# Altium schematic sheet Licznik_mili_sekund.SchDoc
size A4; SheetNumber: 7; SheetTotal: 8
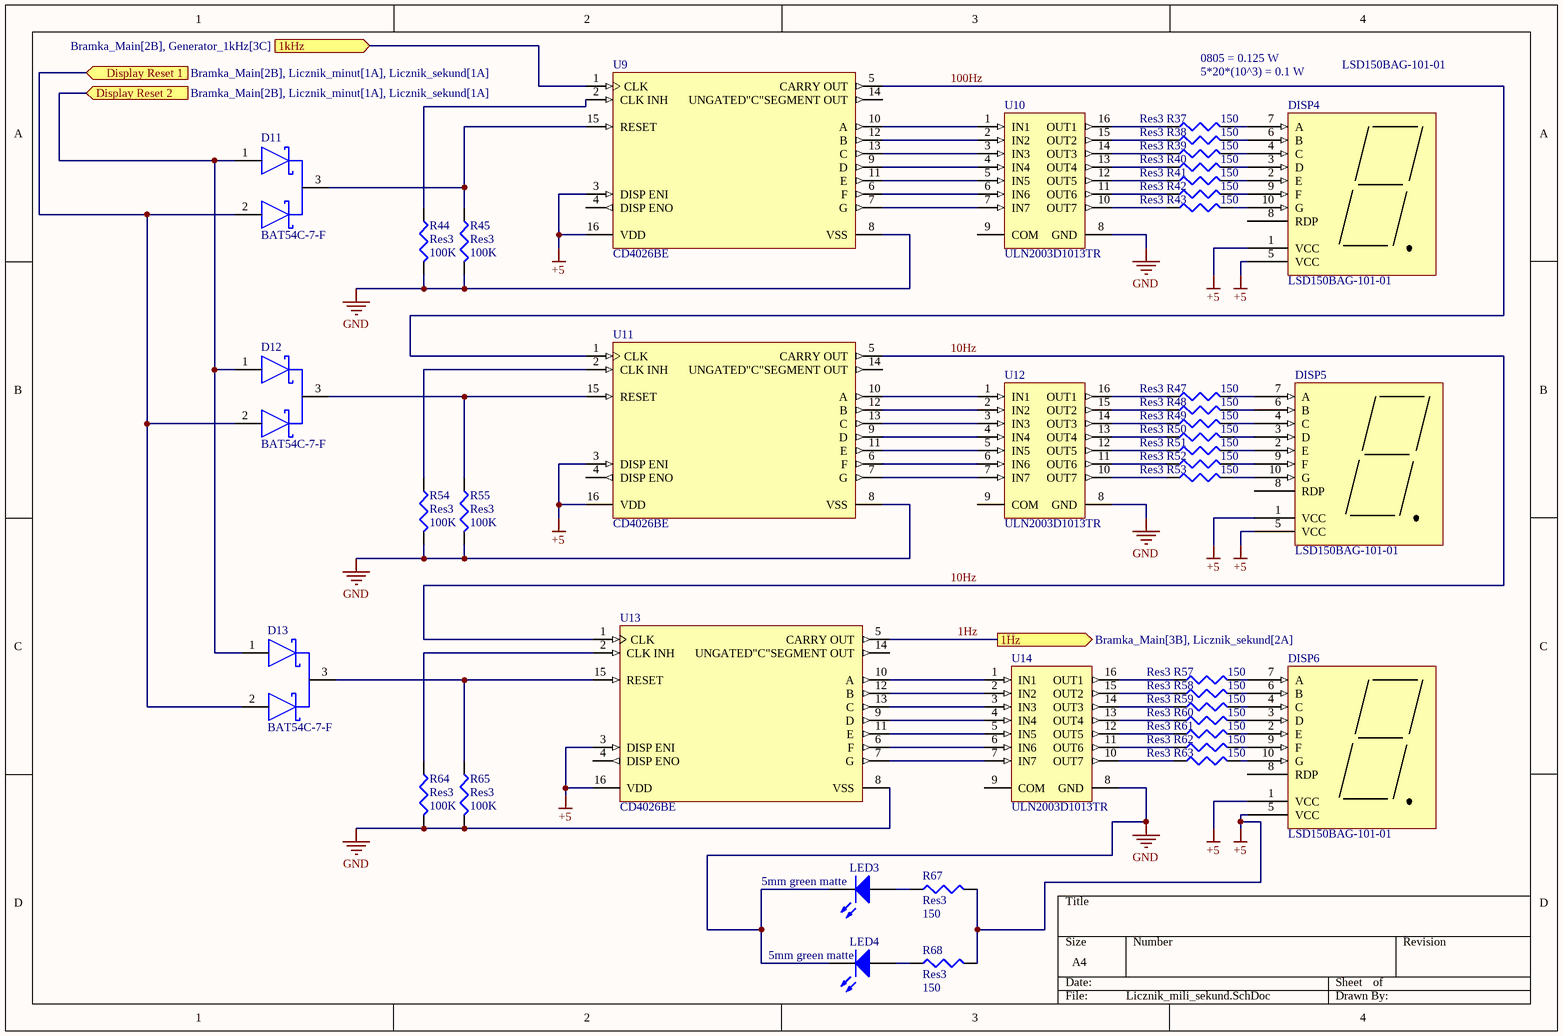
[diagram p0: Licznik_mili_sekund.SchDoc]

## Parts
D11  BAT54C-7-F  [FP-SOT23-IPC_B]
D12  BAT54C-7-F  [FP-SOT23-IPC_B]
D13  BAT54C-7-F  [FP-SOT23-IPC_B]
DISP4  LSD150BAG-101-01  [7 segment display]
DISP5  LSD150BAG-101-01  [7 segment display]
DISP6  LSD150BAG-101-01  [7 segment display]
LED3  5mm green matte  [Type 5mm]
LED4  5mm green matte  [Type 5mm]
R37  Res3  value 150  [6-0805_M]
R38  Res3  value 150  [6-0805_M]
R39  Res3  value 150  [6-0805_M]
R40  Res3  value 150  [6-0805_M]
R41  Res3  value 150  [6-0805_M]
R42  Res3  value 150  [6-0805_M]
R43  Res3  value 150  [6-0805_M]
R44  Res3  value 100K  [J1-0603]
R45  Res3  value 100K  [J1-0603]
R47  Res3  value 150  [6-0805_M]
R48  Res3  value 150  [6-0805_M]
R49  Res3  value 150  [6-0805_M]
R50  Res3  value 150  [6-0805_M]
R51  Res3  value 150  [6-0805_M]
R52  Res3  value 150  [6-0805_M]
R53  Res3  value 150  [6-0805_M]
R54  Res3  value 100K  [J1-0603]
R55  Res3  value 100K  [J1-0603]
R57  Res3  value 150  [6-0805_M]
R58  Res3  value 150  [6-0805_M]
R59  Res3  value 150  [6-0805_M]
R60  Res3  value 150  [6-0805_M]
R61  Res3  value 150  [6-0805_M]
R62  Res3  value 150  [6-0805_M]
R63  Res3  value 150  [6-0805_M]
R64  Res3  value 100K  [J1-0603]
R65  Res3  value 100K  [J1-0603]
R67  Res3  value 150  [6-0805_M]
R68  Res3  value 150  [6-0805_M]
U9  CD4026BE  [N0016A]
U10  ULN2003D1013TR  [STM-SO-16_M]
U11  CD4026BE  [N0016A]
U12  ULN2003D1013TR  [STM-SO-16_M]
U13  CD4026BE  [N0016A]
U14  ULN2003D1013TR  [STM-SO-16_M]

## Ports
1Hz (out, see Bramka_Main[3B], Licznik_sekund[2A]), 1kHz (in, see Bramka_Main[2B], Generator_1kHz[3C]), Display Reset 1 (in, see Bramka_Main[2B], Licznik_minut[1A], Licznik_sekund[1A]), Display Reset 2 (in, see Bramka_Main[2B], Licznik_minut[1A], Licznik_sekund[1A])

## Nets
+5: DISP4.1(VCC) DISP4.5(VCC) DISP5.1(VCC) DISP5.5(VCC) DISP6.1(VCC) DISP6.5(VCC) R67.2 R68.2 U9.3(DISP_ENI) U9.16(VDD) U11.3(DISP_ENI) U11.16(VDD) U13.3(DISP_ENI) U13.16(VDD)
GND: LED3.1(K) LED4.1(K) R44.2 R45.2 R54.2 R55.2 R64.2 R65.2 U9.8(VSS) U10.8(GND) U11.8(VSS) U12.8(GND) U13.8(VSS) U14.8(GND)
1Hz: U13.5(CARRY_OUT) ; port 1Hz
1kHz: U9.1(CLK) ; port 1kHz
10Hz: U11.5(CARRY_OUT) U13.1(CLK)
100Hz: U9.5(CARRY_OUT) U11.1(CLK)
Display Reset 1: D11.2(2_ANODE) D12.2(2_ANODE) D13.2(2_ANODE) ; port Display Reset 1
Display Reset 2: D11.1(1_ANODE) D12.1(1_ANODE) D13.1(1_ANODE) ; port Display Reset 2
NetD11_3: D11.3(COMMON_CATHODE) R45.1 U9.15(RESET)
NetD12_3: D12.3(COMMON_CATHODE) R55.1 U11.15(RESET)
NetD13_3: D13.3(COMMON_CATHODE) R65.1 U13.15(RESET)
NetDISP4_2: DISP4.2(E) R41.2
NetDISP4_3: DISP4.3(D) R40.2
NetDISP4_4: DISP4.4(C) R39.2
NetDISP4_6: DISP4.6(B) R38.2
NetDISP4_7: DISP4.7(A) R37.2
NetDISP4_9: DISP4.9(F) R42.2
NetDISP4_10: DISP4.10(G) R43.2
NetDISP5_2: DISP5.2(E) R51.2
NetDISP5_3: DISP5.3(D) R50.2
NetDISP5_4: DISP5.4(C) R49.2
NetDISP5_6: DISP5.6(B) R48.2
NetDISP5_7: DISP5.7(A) R47.2
NetDISP5_9: DISP5.9(F) R52.2
NetDISP5_10: DISP5.10(G) R53.2
NetDISP6_2: DISP6.2(E) R61.2
NetDISP6_3: DISP6.3(D) R60.2
NetDISP6_4: DISP6.4(C) R59.2
NetDISP6_6: DISP6.6(B) R58.2
NetDISP6_7: DISP6.7(A) R57.2
NetDISP6_9: DISP6.9(F) R62.2
NetDISP6_10: DISP6.10(G) R63.2
NetLED3_2: LED3.2(A) R67.1
NetLED4_2: LED4.2(A) R68.1
NetR37_1: R37.1 U10.16(OUT1)
NetR38_1: R38.1 U10.15(OUT2)
NetR39_1: R39.1 U10.14(OUT3)
NetR40_1: R40.1 U10.13(OUT4)
NetR41_1: R41.1 U10.12(OUT5)
NetR42_1: R42.1 U10.11(OUT6)
NetR43_1: R43.1 U10.10(OUT7)
NetR44_1: R44.1 U9.2(CLK_INH)
NetR47_1: R47.1 U12.16(OUT1)
NetR48_1: R48.1 U12.15(OUT2)
NetR49_1: R49.1 U12.14(OUT3)
NetR50_1: R50.1 U12.13(OUT4)
NetR51_1: R51.1 U12.12(OUT5)
NetR52_1: R52.1 U12.11(OUT6)
NetR53_1: R53.1 U12.10(OUT7)
NetR54_1: R54.1 U11.2(CLK_INH)
NetR57_1: R57.1 U14.16(OUT1)
NetR58_1: R58.1 U14.15(OUT2)
NetR59_1: R59.1 U14.14(OUT3)
NetR60_1: R60.1 U14.13(OUT4)
NetR61_1: R61.1 U14.12(OUT5)
NetR62_1: R62.1 U14.11(OUT6)
NetR63_1: R63.1 U14.10(OUT7)
NetR64_1: R64.1 U13.2(CLK_INH)
NetU9_6: U9.6(F) U10.6(IN6)
NetU9_7: U9.7(G) U10.7(IN7)
NetU9_9: U9.9(D) U10.4(IN4)
NetU9_10: U9.10(A) U10.1(IN1)
NetU9_11: U9.11(E) U10.5(IN5)
NetU9_12: U9.12(B) U10.2(IN2)
NetU9_13: U9.13(C) U10.3(IN3)
NetU11_6: U11.6(F) U12.6(IN6)
NetU11_7: U11.7(G) U12.7(IN7)
NetU11_9: U11.9(D) U12.4(IN4)
NetU11_10: U11.10(A) U12.1(IN1)
NetU11_11: U11.11(E) U12.5(IN5)
NetU11_12: U11.12(B) U12.2(IN2)
NetU11_13: U11.13(C) U12.3(IN3)
NetU13_6: U13.6(F) U14.6(IN6)
NetU13_7: U13.7(G) U14.7(IN7)
NetU13_9: U13.9(D) U14.4(IN4)
NetU13_10: U13.10(A) U14.1(IN1)
NetU13_11: U13.11(E) U14.5(IN5)
NetU13_12: U13.12(B) U14.2(IN2)
NetU13_13: U13.13(C) U14.3(IN3)

Not connected (* = marked no-connect by the designer): DISP4 8(RDP); DISP5 8(RDP); DISP6 8(RDP); U9 4(DISP_ENO) 14(UNGATED"C"SEGMENT_OUT); U10 9(COM); U11 4(DISP_ENO) 14(UNGATED"C"SEGMENT_OUT); U12 9(COM); U13 4(DISP_ENO) 14(UNGATED"C"SEGMENT_OUT); U14 9(COM)

## Notes on the sheet
- 5*20*(10^3) = 0.1 W
- 0805 = 0.125 W
- LSD150BAG-101-01

## Library data of the parts
D11-D13 = CMP-12790-000084-1: DIODE ARRAY SCHOTTKY 30V SOT23-3; Max Reverse Current: 2uA; Power Dissipation: 200mW; Average Rectified Current: 200mA; Capacitance: 10pF; Peak Non-Repetitive Surge Current: 600mA; Forward Voltage: 800mV; Reverse Recovery Time: 5ns; Element Configuration: Common Cathode; Max Operating Temperature: 150°C; Max Reverse Voltage (DC): 30V; Power Rating: 200mW; Termination: SMD/SMT; REACH SVHC: No SVHC; Voltage Rating (DC): 30V; Series: -; Current Rating: 200mA; RoHS Compliant: Yes; Max Power Dissipation: 200mW; Case/Package: SOT-23; Max Repetitive Reverse Voltage (Vrrm): 30V; Width: 1.3mm; Min Operating Temperature: -65°C; Lead Free: Lead Free; Forward Current: 200mA; Number of Pins: 3; Contact Plating: Tin; Package Quantity: 3000; Length: 2.9mm; Radiation Hardening: No; Max Forward Surge Current (Ifsm): 600mA; Height: 1mm; Packaging: Tape and Reel; Mount: Surface Mount; Weight: 0.000282oz
DISP4-DISP6 = CMP-007-00036-2: 7 segment display 1.5 inch
LED3 LED4 = CMP-1488-00007-1: THT LED round mono-color color lens, WL-TMRW, Bright Green; PartNumber: 151051VS04000; Manufacturer: Wuerth Elektronik; Emitting color: Bright Green; ComponentLink1Description: Manufacturer URL; PackageReference: Type 5mm; ComponentLink2URL: http://katalog.we-online.de/pbs/datasheet/7448042001.pdfhttp://katalog.we-online.de/pbs/datasheet/7448042001.pdfhttp://katalog.we-online.de/pbs/datasheet/7448042001.pdfhttp://katalog.we-online.de/pbs/datasheet/151051VS04000.pdf; ComponentLink1URL: http://www.we-online.com; ComponentLink2Description: Datasheet
R37-R45 R47-R55 R57-R65 R67 R68 = Res3: Resistor; Published: 8-Jun-2000; LatestRevisionDate: 29-May-2009; LatestRevisionNote: IPC-7351 Footprint Added.; PackageReference: J1-0603; Publisher: Altium Limited; PackageDescription: Chip Resistor
U9 U11 U13 = CMP-1623-00561-2: CMOS Decade Counter/Divider with Decoded 7-Segment Display Outputs and Display Enable, N0016A, TUBE; Manufacturer: Texas Instruments; ICC @ Nom Voltage(Max)(mA): 0.03; tpd @ Nom Voltage(Max)(ns): 250; F @ Nom Voltage(Max)(Mhz): 8; Bits(#): 7; VCC(Max)(V): 18; VCC(Min)(V): 3; Output Drive (IOL/IOH)(Max)(mA): 1.5/-1.5; Inputs: 1; Rating: Catalog; Technology Family: CD4000; Schmitt Trigger: No; Voltage(Nom)(V): 5,10,15; DatasheetVersion: SCHS031B; Operating Temperature Range(C): -55 to 125; Code_JEDEC: MS-001; Input Type: CMOS; Output Type: CMOS; Type: Decade; Generic Part Number: CD4026B; PackageReference: N0016A; Function: Counter
U10 U12 U14 = CMP-2000-05374-1: Seven NPN Darlington Array Transistor, 50 V, 500 mA, -40 to 85 degC, 8-Pin SOIC, RoHS, Tape and Reel; Manufacturer: STMicroelectronics; Collector Emitter Voltage V(br)ceo: 50V; SVHC: NoSVHC(17-Dec-2015); DC Current Gain hFE: 1000hFE; DC Collector Current: 500mA; No. of Pins: 16Pins; Package Reference: SO-16; Transistor Polarity: NPN; Transistor Case Style: SOIC; Datasheet URL: https://datasheet.ciiva.com/1193/1690348-1193460.pdf; Package Description: 16-Pin Small Outline Integrated Circuit, Body 9.9 x 3.9 mm, Pitch 1.27 mm; Datasheet Version: Rev. 8, 06/2012; Power Dissipation Pd: -; Product Range: -; Operating Temperature Max: 85degC; MSL: MSL1-Unlimited; Manufacturer URL: http://www.st.com/; Automotive Qualification Standard: -